# EAGLE schematic PPGShieldSmall-V0.2.1 (EAGLE 9.5.2)
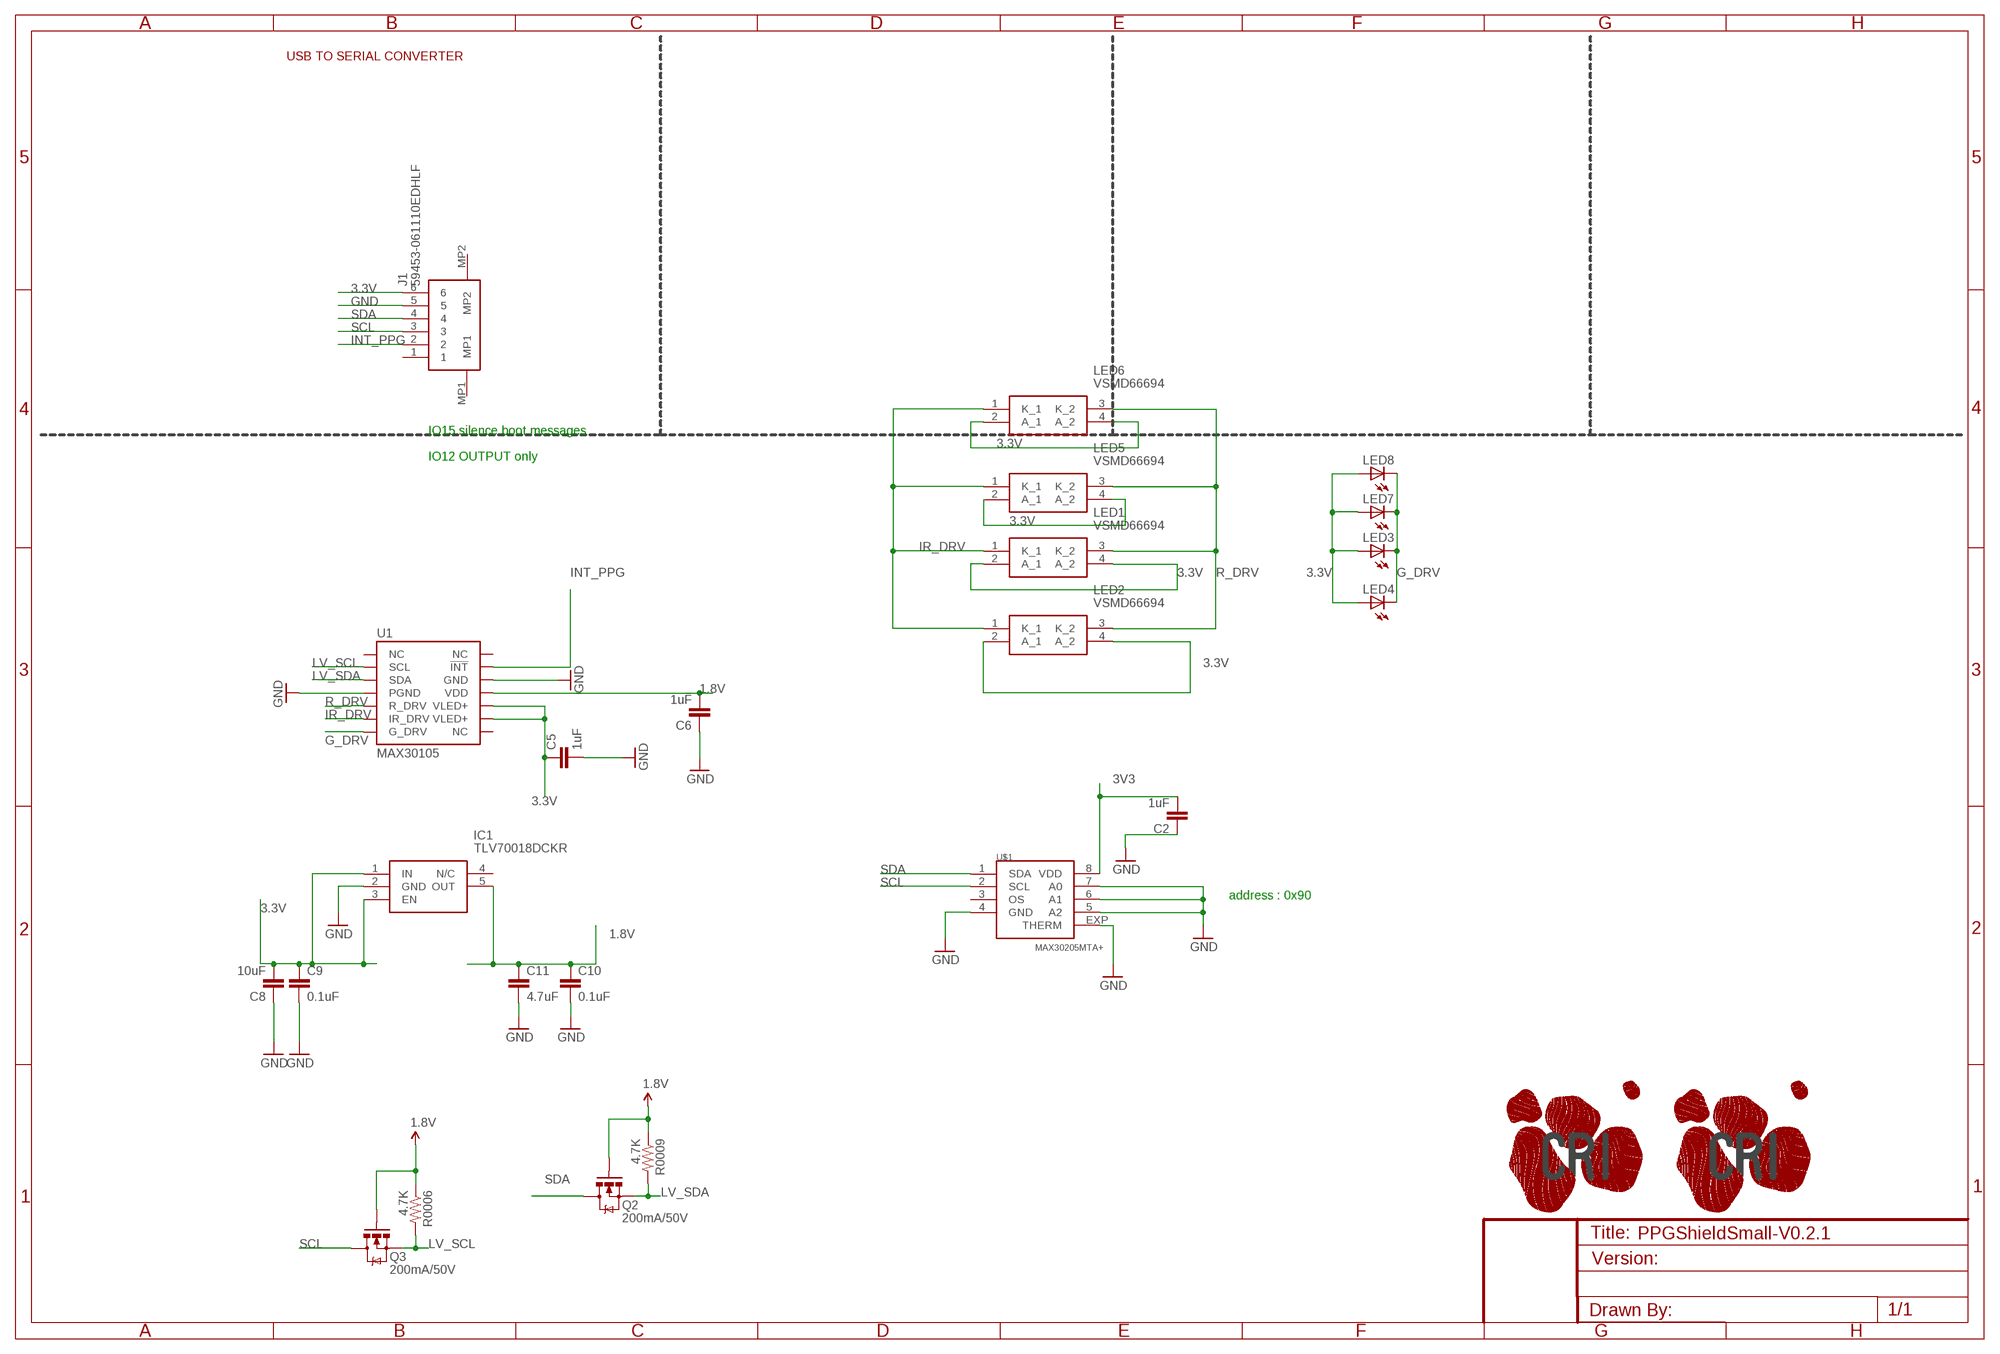
[diagram p0: schematic, sheet 1]

## Parts
C2  1uF  CAP0402-1UF  [0402-CAP]
C5  1uF  CAP0402-1UF  [0402-CAP]
C6  1uF  CAP0402-1UF  [0402-CAP]
C8  10uF  CAP0402-10UF-MURATA  [0402-RES]
C9  0.1uF  CAP0402-0.1UF  [0402-CAP]
C10  0.1uF  CAP0402-0.1UF  [0402-CAP]
C11  4.7uF  CAP0402-0.1UF  [0402-CAP]
IC1  TLV70018DCKR  [SOT65P210X110-5N]
J1  59453-061110EDHLF  [59453061110EDHLF]
LED1  VSMD66694  [VSMD66694]
LED2  VSMD66694  [VSMD66694]
LED3  LED0603  [LED-0603]
LED4  LED0603  [LED-0603]
LED5  VSMD66694  [VSMD66694]
LED6  VSMD66694  [VSMD66694]
LED7  LED0603  [LED-0603]
LED8  LED0603  [LED-0603]
Q2  200mA/50V  MOSFET-NCHANNELBSS138  [SOT23-3]
Q3  200mA/50V  MOSFET-NCHANNELBSS138  [SOT23-3]
R0006  4.7K  RESISTOR0402-4K7  [0402-RES]
R0009  4.7K  RESISTOR0402-4K7  [0402-RES]
U1  MAX30105  MAX30105SMD  [OLGA-14]
U$1  MAX30205MTA+  [TDFN-08]
U$3  LOGO-CRI-NEW-110MM-BOTTOM-SILK  [LOGO_CRI-NEW-BMP10MM-BOTTOM]
U$4  LOGO-CRI-NEW-110MM-BOTTOM-SILK  [LOGO_CRI-NEW-BMP10MM-BOTTOM]

## Nets
1.8V [Eurocircuits-Classe7-drill0.15]: C6.2 C10.1 C11.1 IC1.5(OUT) Q2.1(G) Q3.1(G) R0006.1 R0009.1 U1.11(VDD)
3.3V [Eurocircuits-Classe7-drill0.15]: C5.1 C8.2 C9.1 IC1.1(IN) IC1.3(EN) J1.6 LED1.2(A_1) LED1.4(A_2) LED2.2(A_1) LED2.4(A_2) LED3.A LED4.A LED5.2(A_1) LED5.4(A_2) LED6.2(A_1) LED6.4(A_2) LED7.A LED8.A U1.9(VLED+) U1.10(VLED+)
3V3 [Eurocircuits-Classe7-drill0.15]: C2.2 U$1.8(VDD)
G_DRV [Eurocircuits-Classe7-drill0.15]: LED3.C LED4.C LED7.C LED8.C U1.7(G_DRV)
GND [Eurocircuits-Classe7-drill0.15]: C2.1 C5.2 C6.1 C8.1 C9.2 C10.2 C11.2 IC1.2(GND) J1.5 U1.4(PGND) U1.12(GND) U$1.4(GND) U$1.5(A2) U$1.6(A1) U$1.7(A0) U$1.EXP(THERM)
INT_PPG [Eurocircuits-Classe7-drill0.15]: J1.2 U1.13(!INT)
IR_DRV [Eurocircuits-Classe7-drill0.15]: LED1.1(K_1) LED2.1(K_1) LED5.1(K_1) LED6.1(K_1) U1.6(IR_DRV)
LV_SCL [Eurocircuits-Classe7-drill0.15]: Q3.2(S) R0006.2 U1.2(SCL)
LV_SDA [Eurocircuits-Classe7-drill0.15]: Q2.2(S) R0009.2 U1.3(SDA)
R_DRV [Eurocircuits-Classe7-drill0.15]: LED1.3(K_2) LED2.3(K_2) LED5.3(K_2) LED6.3(K_2) U1.5(R_DRV)
SCL [Eurocircuits-Classe7-drill0.15]: J1.3 Q3.3(D) U$1.2(SCL)
SDA [Eurocircuits-Classe7-drill0.15]: J1.4 Q2.3(D) U$1.1(SDA)
Unconnected: IC1.4(N/C) J1.1 J1.MP1 J1.MP2 U1.1(NC) U1.8(NC) U1.14(NC) U$1.3(OS)

## Notes on the sheet
- USB TO SERIAL CONVERTER
- IO15 silence boot messages
- IO12 OUTPUT only
- address : 0x90

## Library data of the parts
C2 C5 C6 = movuino:CAP: Capacitor Standard 0402 ceramic capacitor 0.1uF , 100nF; DIELECTRIC: MLCC, X5R; MF: Murata Electronics; MPN: GRM155R61A105KE15D; OC_MOUSER: 81-GRM155R61A105KE15; OC_RS: 7235199; TOLERANCE: 10%; VOLTAGE: 10V
C8 = movuino:CAP: Capacitor Standard 0402 ceramic capacitor 0.1uF , 100nF; MF: Murata Electronics; OC_MOUSER: 81-GRM155R60J106ME4D; OC_RS: 8467274; TOLERANCE: 20%; VOLTAGE: 6.3V
C9 C10 = movuino:CAP: Capacitor Standard 0402 ceramic capacitor 0.1uF , 100nF; DIELECTRIC: MLCC, X5R; MF: Murata Electronics; MPN: GRM155R61C104KA88D; OC_MOUSER: 81-GRM155R61C104KA8D; OC_RS: 7235200; TOLERANCE: 10%; VOLTAGE: 16V
C11 = movuino:CAP: Capacitor Standard 0402 ceramic capacitor 0.1uF , 100nF; DIELECTRIC: MLCC, X5R; MF: Murata Electronics; MPN: GRM155R61C104KA88D; OC_MOUSER: 81-GRM155R61C104KA8D; OC_RS: 7235200; TOLERANCE: 10%; VALUE: 0.1uF; VOLTAGE: 16V
IC1 = movuino:TLV70018DCKR: 200-mA, Low-IQ, Low-Dropout Regulator for Portable Devices Source: Datasheet <http://www.ti.com/lit/gpn/tlv700>; DESCRIPTION: 200-mA, Low-IQ, Low-Dropout Regulator for Portable Devices; HEIGHT: 1.1mm; MANUFACTURER_NAME: Texas Instruments; MANUFACTURER_PART_NUMBER: TLV70018DCKR; MOUSER_PART_NUMBER: 595-TLV70018DCKR; MOUSER_PRICE-STOCK: https://www.mouser.com/Search/Refine.aspx?Keyword=595-TLV70018DCKR
J1 = movuino:59453-061110EDHLF: 4w FFC SMT header bottom contact 0.5mm Source: Datasheet <http://portal.fciconnect.com/Comergent//fci/drawing/59453-0_1110edhlf.pdf>
LED1 LED2 LED5 LED6 = movuino:VSMD66694: Red + IR LED 660/940nm 60deg SMD 1206 Source: Datasheet <https://componentsearchengine.com/Datasheets/1/VSMD66694.pdf>; DESCRIPTION: Red + IR LED 660/940nm 60deg SMD 1206; HEIGHT: 0.97mm; MANUFACTURER_NAME: Vishay; MANUFACTURER_PART_NUMBER: VSMD66694; MOUSER_PART_NUMBER: 78-VSMD66694; MOUSER_PRICE-STOCK: https://www.mouser.com/Search/Refine.aspx?Keyword=78-VSMD66694
LED3 LED4 LED7 LED8 = movuino:LED: LEDs Standard schematic elements and footprints for 5mm, 3mm, 1206, and 0603 sized LEDs. 5mm - Spark Fun Electronics SKU : COM-00529 (and others)
Q2 Q3 = SparkFun-DiscreteSemi:MOSFET-NCHANNEL: Common NMOSFET Parts MFG P/N Store ID Prod ID FDD8780 TRANS-09984 SI7820DN TRANS-11055 FDS6630A IC-08089 2N7002PW TRANS-11151 FQP30N06L COM-10213 TRANS-10060 BSS123LT1G TRANS-08345 BSS138 TRANS-00830 BS170 2N7000; PROD_ID: TRANS-00830
R0006 R0009 = movuino:RESISTOR: Resistor Basic schematic elements and footprints for 0603, 1206, and PTH resistors.; MF: TE Connectivity; MPN: CRG0402F4K7; OC_MOUSER: 279-CRG0402F4K7; OC_RS: 6678794; POWER_RATING: 0.063W; TOLERANCE: 1%
U1 = movuino:MAX30105: Description: Particle Detection IC. Primarily used for smoke detection, can be used for Pulse Detection, Pulse Ox, and possible visual particle detection.; PROD_ID: IC-13510
U$1 = circuitects:MAX30205
U$3 U$4 = movuino_aestheticsV0:LOGO-CRI-NEW-1

## Net classes
1 pcbway_smallest: width 0.102 mm, drill 0.2 mm, clearance 0.102 mm
2 pcbway_cheap: width 0.152 mm, drill 0.3 mm, clearance 0.152 mm
3 pcbway_5mil: width 0.127 mm, drill 0.25 mm, clearance 0.127 mm
4 EC-drill0.15: width 0.1 mm, drill 0.15 mm, clearance 0.1 mm
5 Eurocircuits-Classe7-drill0.15: width 0.125 mm, drill 0.15 mm, clearance 0.125 mm